# EAGLE design PowerLatch (EAGLE 9.4.0)
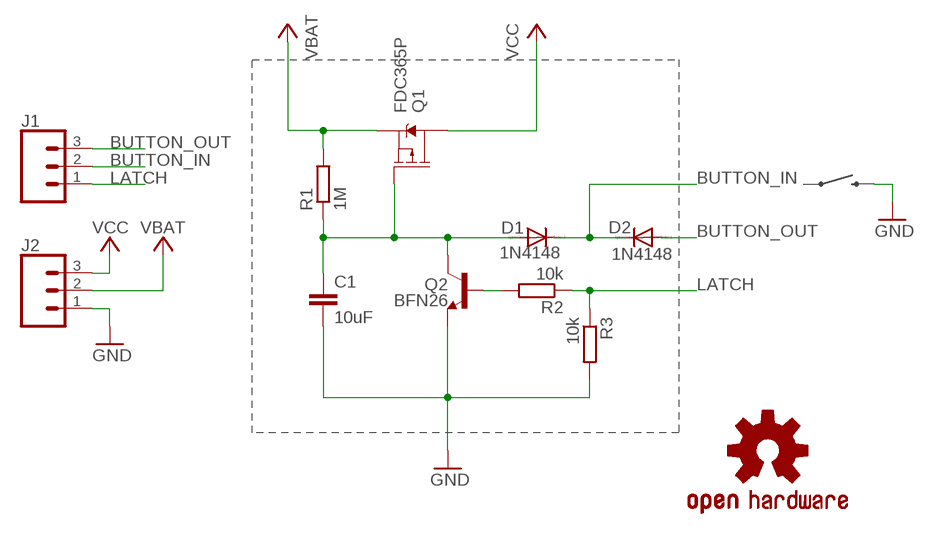
[diagram p0: schematic, sheet 1]

## Parts
C1  10uF  C-EUC0603  [C0603]
D1  1N4148  DIODE-SOD523  [SOD523]
D2  1N4148  DIODE-SOD523  [SOD523]
J1  455-1750-1-ND  CONN_03  [1X03]
J2  455-1750-1-ND  CONN_03  [1X03]
LOGO1  OSHW-LOGOS  [OSHW-LOGO-S]
Q1  FDC365P  MOSFET_PCH-FDC365P  [SSOT6]
Q2  BFN26  TRANS_NPN-BFN26  [SOT23-3]
R1  1M  R-EU_R0603  [R0603]
R2  10k  R-EU_R0603  [R0603]
R3  10k  R-EU_R0603  [R0603]

## Nets
BUTTON_IN: D1.C D2.C J1.2
BUTTON_OUT: D2.A J1.3
GND: C1.2 J2.1 Q2.2(E) R3.2
LATCH: J1.1 R2.1 R3.1
N$5: Q2.1(B) R2.2
N$10: C1.1 D1.A Q1.3(G) Q2.3(C) R1.1
VBAT: J2.2 Q1.4(S) R1.2
VCC: J2.3 Q1.1(D) Q1.2(D) Q1.5(D) Q1.6(D)

## Library data of the parts
C1 = rcl:C-EU: CAPACITOR, European symbol; SPICEPREFIX: C
D1 D2 = diode:DIODE-: DIODE
J1 J2 = SparkFun-Connectors:CONN_03: Multi connection point. Often used as Generic Header-pin footprint for 0.1 inch spaced/style header connections On any of the 0.1 inch spaced packages, you can populate with these: Break Away Headers - Straight <https://www.sparkfun.com/products/116> (PRT-00116) Break Away Male Headers - Right Angle <https://www.sparkfun.com/products/553> (PRT-00553) Female Headers <https://www.sparkfun.com/products/115> (PRT-00115) Break Away Headers - Machine Pin <https://www.sparkfun.com/products/117> (PRT-00117) Break Away Female Headers - Swiss Machine Pin <https://www.sparkfun.com/products/743> (PRT-00743) Stackable Header - 3 Pin (Female, 0.1") <https://www.sparkfun.com/products/13875> (PRT-13875) For SCREWTERMINALS and SPRING TERMINALS visit here: Screw Terimnals on SparkFun.com <https://www.sparkfun.com/search/results?term=Screw+Terminals> (5mm/3.5mm/2.54mm spacing) This device is also useful as a general connection point to wire up your design to another part of your project. Our various solder wires solder well into these plated through hole pads. Hook-Up Wire - Assortment (Stranded, 22 AWG) <https://www.sparkfun.com/products/11375> (PRT-11375) Hook-Up Wire - Assortment (Solid Core, 22 AWG) <https://www.sparkfun.com/products/11367> (PRT-11367) View the entire wire category on our website here <https://www.sparkfun.com/categories/141> Special notes: Molex polarized connector foot print use with SKU : PRT-08232 with associated crimp pins and housings.; PROD_ID: XXX-00000
LOGO1 = SparkFun-Aesthetics:OSHW-LOGO: Open-Source Hardware (OSHW) Logo This logo indicates the piece of hardware it is found on incorporates a OSHW license and/or adheres to the definition of open source hardware found here: http://freedomdefined.org/OSHW
Q1 = pmc_lib:MOSFET_PCH: P-channel MOSFETs Voltage controlled devices that allow control of high current outputs. SparkFun Products: SparkFun ESP32 Thing <https://www.sparkfun.com/products/13907> SparkFun ESP8266 Thing <https://www.sparkfun.com/products/13231>; SPICEPREFIX: Q
Q2 = pmc_lib:TRANS_NPN: NPN transistor Current controlled devices typically used to amplify current or used as a switch. BC547 - COM-08928 <http://www.sparkfun.com/products/8928> (TO-92 45V 100mA) (1.Collector 2.Base 3.Emitter) 2N3904 - COM-00521 <http://www.sparkfun.com/products/521> (TO-92 40V 200mA) (1.Emitter 2.Base 3.Collector) P2N2222A - COM-12852 <http://www.sparkfun.com/products/12852> (TO-92 40V 600mA) (1.Collector 2.Base 3.Emitter)
R1-R3 = rcl:R-EU_: RESISTOR, European symbol; SPICEPREFIX: R

## Board
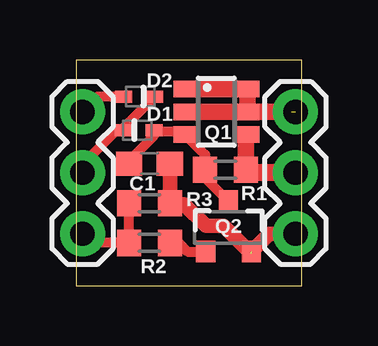
[diagram p1: board, top side]
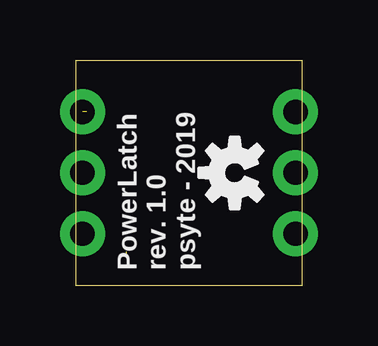
[diagram p2: board, bottom side, seen from below]

Size 9.4 x 9.4 mm. Coordinates in mm from the lower left corner, seen from the top.
Outline: 0,0 9.4,0 9.4,9.4 0,9.4 0,0
Copper layers (1*16): Top 0.035mm / dielectric 1.5mm / Bottom 0.035mm
Design rules "default *": minimum track width 6mil, minimum drill 0.35mm, track to track 10mil, track to pad 10mil, pad to pad 8mil, via to via 8mil, smd to smd 8mil, copper to edge 40mil, drill to drill 6mil, minimum pad ring 10mil, minimum via ring 8mil, stop-mask expansion 1mil, vias tented up to drill 0mil, thermal gap 10mil

### Footprints (pad centres in the part's own frame; a part is rotated, then mirrored left to right if it is on the bottom)
C0603 = smd 1.1 x 1: 1 -0.85,0; 2 0.85,0
SOD523 = smd 0.7 x 0.5: A 0.7,0; C -0.6,0
1X03 = drill 1.016 pad 1.88: 1 0,0; 2 2.54,0; 3 5.08,0
SSOT6 = smd 0.69 x 0.99: 1 -0.95,-1.3; 2 0,-1.3; 3 0.95,-1.3; 4 0.95,1.3; 5 0,1.3; 6 -0.95,1.3
SOT23-3 = smd 0.8 x 0.9: 1 -0.95,-1; 2 0.95,-1; 3 0,1.1
R0603 = smd 1 x 1.1: 1 -0.85,0; 2 0.85,0

### Placement (x,y rotation side)
C1  3.05,5.08 0 top
D1  2.54,6.48 0 top
D2  2.67,7.87 180 top
J1  0.25,2.16 90 top
J2  9.14,2.16 90 top
LOGO1  2.79,4.7 90 bottom
Q1  5.84,7.24 270 top
Q2  6.35,2.41 0 top
R1  6.22,4.83 0 top
R2  3.05,1.78 0 top
R3  3.05,3.43 0 top

### Tracks (layer width: path | path; a pad name or v marks a point on that pad's centre or on a via)
BUTTON_IN
  Top 0.406: J1.2 0.25,5.04 1.69,6.48 D1.C 1.94,6.55 D2.C
BUTTON_OUT
  Top 0.406: D2.A 0.89,7.87 J1.3
GND  (1 unrouted)
  Top 0.61: J2.1 8.05,2.16 Q2.2 | C1.2 R3.2 3.93,3.4 4.5,3.4 5.41,2.49 6.14,2.49 7.3,1.32
LATCH
  Top 0.406: J1.1 0.64,1.78 R2.1 R3.1
N$5
  Top 0.406: R2.2 4.27,1.78 4.64,1.41 Q2.1
N$10
  Top 0.406: Q2.3 5.37,4.49 R1.1 5.37,5.46 Q1.3 4.42,6.42 3.3,6.42 D1.A 3.24,6.25 2.2,5.21 C1.1
VBAT
  Top 0.686: R1.2 7.07,6.22 Q1.4
  Top 0.711: J2.2 7.2,4.7 R1.2
VCC  (1 unrouted)
  Top 0.686: Q1.1 Q1.6 | Q1.2 Q1.5 | Q1.5 8.97,7.24 | Q1.5 7.14,8.02

### Text on the board
bPlace: PowerLatch / rev. 1.0 / psyte - 2019